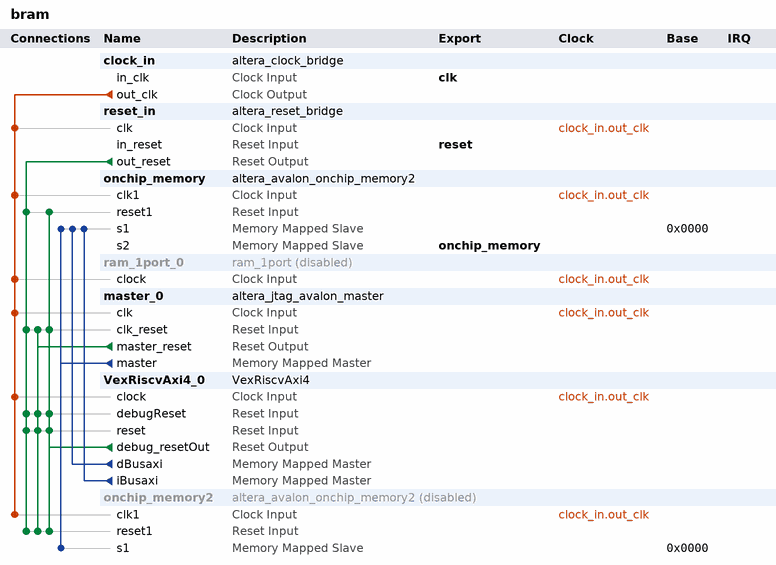
[diagram p0: system contents]
# Platform Designer (Qsys) system bram, Arria 10 10AX115N2F40E2LG
# Parameters at their usual value, and those the tool derives, are not listed.
package require -exact qsys 1.0
create_system bram
set_project_property DEVICE_FAMILY {Arria 10}
set_project_property DEVICE 10AX115N2F40E2LG

add_component clock_in ip/bram/bram_clock_in.ip altera_clock_bridge clock_in 19.1
load_component clock_in
set_component_parameter_value DERIVED_CLOCK_RATE 0
set_component_parameter_value EXPLICIT_CLOCK_RATE 50000000
save_component

add_component reset_in ip/bram/bram_reset_in.ip altera_reset_bridge reset_in 19.1
load_component reset_in
set_component_parameter_value ACTIVE_LOW_RESET 1
set_component_parameter_value SYNCHRONOUS_EDGES deassert
set_component_parameter_value SYNC_RESET 0
save_component

add_component onchip_memory ip/bram/bram_onchip_memory2_0.ip altera_avalon_onchip_memory2 onchip_memory 19.1
load_component onchip_memory
set_component_parameter_value dataWidth 32
set_component_parameter_value dualPort true
set_component_parameter_value enableDiffWidth true
set_component_parameter_value initMemContent true
set_component_parameter_value initializationFileName onchip_mem.hex
set_component_parameter_value instanceID mem1
set_component_parameter_value memorySize 4095
set_component_parameter_value singleClockOperation true
set_component_parameter_value resetrequest_enabled false
save_component

add_component ram_1port_0 ip/bram/bram_ram_1port_0.ip ram_1port ram_1port_0 19.1
load_component ram_1port_0
set_instance_property ram_1port_0 ENABLED false
set_component_parameter_value GUI_RegData true
set_component_parameter_value GUI_RegAddr true
set_component_parameter_value GUI_RegOutput true
set_component_parameter_value GUI_Clken false
set_component_parameter_value GUI_CLOCK_ENABLE_INPUT_A false
set_component_parameter_value GUI_CLOCK_ENABLE_OUTPUT_A false
set_component_parameter_value GUI_ADDRESSSTALL_A false
set_component_parameter_value GUI_BYTE_ENABLE false
set_component_parameter_value GUI_AclrData false
set_component_parameter_value GUI_WRCONTROL_ACLR_A false
set_component_parameter_value GUI_AclrAddr false
set_component_parameter_value GUI_AclrOutput false
set_component_parameter_value GUI_AclrByte false
set_component_parameter_value GUI_SclrOutput false
set_component_parameter_value GUI_rden false
set_component_parameter_value GUI_X_MASK false
set_component_parameter_value GUI_INIT_TO_SIM_X false
set_component_parameter_value GUI_JTAG_ENABLED false
set_component_parameter_value GUI_JTAG_ID NONE
set_component_parameter_value GUI_INIT_FILE_LAYOUT PORT_A
set_component_parameter_value GUI_TBENCH false
set_component_parameter_value GUI_FORCE_TO_ZERO false
set_component_parameter_value GUI_PR false
set_component_parameter_value GUI_WIDTH_A 64
set_component_parameter_value GUI_NUMWORDS_A 512
set_component_parameter_value GUI_MAXIMUM_DEPTH 512
set_component_parameter_value GUI_BYTE_SIZE 8
set_component_parameter_value GUI_READ_DURING_WRITE_MODE_PORT_A 0
set_component_parameter_value GUI_OPTIMIZATION_OPTION 1
set_component_parameter_value GUI_RAM_BLOCK_TYPE Auto
set_component_parameter_value GUI_IMPLEMENT_IN_LES 0
set_component_parameter_value GUI_SingleClock 0
set_component_parameter_value GUI_BlankMemory 0
set_component_parameter_value GUI_FILE_REFERENCE 0
set_component_parameter_value GUI_WIDTHAD_A 9
set_component_parameter_value GUI_BYTE_WIDTH 8
set_component_parameter_value GUI_MODULE_NAME altera_syncram
set_component_parameter_value GUI_RESOURCE_USAGE {2 M20K}
save_component

add_component master_0 ip/bram/bram_master_0.ip altera_jtag_avalon_master master_0 19.1
load_component master_0
save_component

add_component VexRiscvAxi4_0 ip/bram/bram_VexRiscvAxi4_0.ip VexRiscvAxi4 VexRiscvAxi4_0 1.0
load_component VexRiscvAxi4_0
save_component

add_component onchip_memory2 ip/bram/bram_onchip_memory2_1.ip altera_avalon_onchip_memory2 onchip_memory2 19.1
load_component onchip_memory2
set_instance_property onchip_memory2 ENABLED false
set_component_parameter_value allowInSystemMemoryContentEditor true
set_component_parameter_value dataWidth 32
set_component_parameter_value dualPort false
set_component_parameter_value initMemContent true
set_component_parameter_value initializationFileName onchip_mem.hex
set_component_parameter_value instanceID mem2
set_component_parameter_value memorySize 4096
save_component

# connections
add_connection clock_in.out_clk master_0.clk clock
add_connection clock_in.out_clk onchip_memory2.clk1 clock
add_connection clock_in.out_clk onchip_memory.clk1 clock
add_connection clock_in.out_clk ram_1port_0.clock clock
add_connection clock_in.out_clk reset_in.clk clock
add_connection clock_in.out_clk VexRiscvAxi4_0.clock clock
add_connection master_0.master_reset master_0.clk_reset reset
add_connection master_0.master_reset onchip_memory2.reset1 reset
add_connection master_0.master_reset VexRiscvAxi4_0.debugReset reset
add_connection master_0.master_reset VexRiscvAxi4_0.reset reset
add_connection reset_in.out_reset master_0.clk_reset reset
add_connection reset_in.out_reset onchip_memory2.reset1 reset
add_connection reset_in.out_reset onchip_memory.reset1 reset
add_connection reset_in.out_reset VexRiscvAxi4_0.debugReset reset
add_connection reset_in.out_reset VexRiscvAxi4_0.reset reset
add_connection VexRiscvAxi4_0.debug_resetOut master_0.clk_reset reset
add_connection VexRiscvAxi4_0.debug_resetOut onchip_memory2.reset1 reset
add_connection VexRiscvAxi4_0.debug_resetOut onchip_memory.reset1 reset
add_connection VexRiscvAxi4_0.debug_resetOut VexRiscvAxi4_0.debugReset reset
add_connection VexRiscvAxi4_0.debug_resetOut VexRiscvAxi4_0.reset reset
add_connection master_0.master onchip_memory2.s1 avalon
set_connection_parameter_value master_0.master/onchip_memory2.s1 baseAddress 0x0000
add_connection master_0.master onchip_memory.s1 avalon
set_connection_parameter_value master_0.master/onchip_memory.s1 baseAddress 0x0000
add_connection VexRiscvAxi4_0.dBusaxi onchip_memory.s1 avalon
set_connection_parameter_value VexRiscvAxi4_0.dBusaxi/onchip_memory.s1 baseAddress 0x0000
add_connection VexRiscvAxi4_0.iBusaxi onchip_memory.s1 avalon
set_connection_parameter_value VexRiscvAxi4_0.iBusaxi/onchip_memory.s1 baseAddress 0x0000

# exported interfaces
add_interface clk clock sink
set_interface_property clk EXPORT_OF clock_in.in_clk
add_interface onchip_memory avalon slave
set_interface_property onchip_memory EXPORT_OF onchip_memory.s2
add_interface reset reset sink
set_interface_property reset EXPORT_OF reset_in.in_reset

save_system bram.qsys
